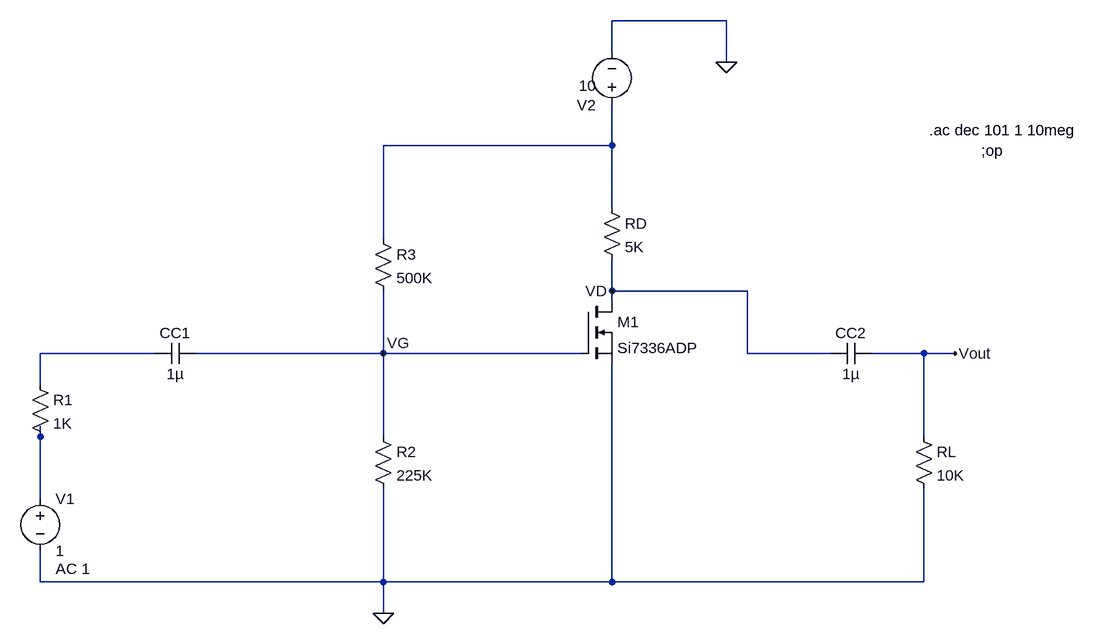
[diagram p0: schematic ec_exp1.asc]
ec_exp1.asc, the LTspice schematic file:
Version 4
SHEET 1 1740 680
WIRE 1184 -448 1008 -448
WIRE 1008 -400 1008 -448
WIRE 1184 -384 1184 -448
WIRE 1008 -256 1008 -320
WIRE 1008 -256 656 -256
WIRE 1008 -160 1008 -256
WIRE 656 -112 656 -256
WIRE 1008 -32 1008 -80
WIRE 1216 -32 1008 -32
WIRE 1008 -16 1008 -32
WIRE 304 64 128 64
WIRE 656 64 656 -32
WIRE 656 64 368 64
WIRE 960 64 656 64
WIRE 1216 64 1216 -32
WIRE 1344 64 1216 64
WIRE 1488 64 1408 64
WIRE 1536 64 1488 64
WIRE 128 112 128 64
WIRE 128 192 128 176
WIRE 656 192 656 64
WIRE 1488 192 1488 64
WIRE 128 288 128 192
WIRE 128 416 128 368
WIRE 656 416 656 272
WIRE 656 416 128 416
WIRE 1008 416 1008 80
WIRE 1008 416 656 416
WIRE 1488 416 1488 272
WIRE 1488 416 1008 416
WIRE 656 464 656 416
FLAG 1184 -384 0
FLAG 656 464 0
FLAG 656 64 VG
FLAG 1008 -32 VD
FLAG 1536 64 Vout
SYMBOL cap 304 48 M90
WINDOW 0 0 32 VBottom 2
WINDOW 3 32 32 VTop 2
SYMATTR InstName CC1
SYMATTR Value 1µ
SYMBOL res 112 96 R0
SYMATTR InstName R1
SYMATTR Value 1K
SYMBOL voltage 128 272 R0
WINDOW 123 24 124 Left 2
WINDOW 39 0 0 Left 0
SYMATTR Value2 AC 1
SYMATTR InstName V1
SYMATTR Value 1
SYMBOL voltage 1008 -304 R180
WINDOW 0 39 30 Bottom 2
WINDOW 3 24 44 Left 2
WINDOW 123 24 44 Left 2
WINDOW 39 0 0 Left 0
SYMATTR InstName V2
SYMATTR Value 10
SYMBOL res 640 176 R0
SYMATTR InstName R2
SYMATTR Value 225K
SYMBOL res 640 -128 R0
SYMATTR InstName R3
SYMATTR Value 500K
SYMBOL nmos 960 -16 R0
SYMATTR InstName M1
SYMATTR Value Si7336ADP
SYMBOL res 992 -176 R0
SYMATTR InstName RD
SYMATTR Value 5K
SYMBOL cap 1408 48 R90
WINDOW 0 0 32 VBottom 2
WINDOW 3 32 32 VTop 2
SYMATTR InstName CC2
SYMATTR Value 1µ
SYMBOL res 1472 176 R0
SYMATTR InstName RL
SYMATTR Value 10K
TEXT 1576 -248 Left 2 !;op
TEXT 1496 -280 Left 2 !.ac dec 101 1 10meg

The netlist it stands for:
* ec_exp1.asc
CC1 N002 VG 1µ
R1 N002 N003 1K
V1 N003 0 1 AC 1
V2 N001 0 10
R2 VG 0 225K
R3 N001 VG 500K
M1 VD VG 0 0 Si7336ADP
RD N001 VD 5K
CC2 Vout VD 1µ
RL Vout 0 10K
.model NMOS NMOS
.model PMOS PMOS
.lib standard.mos
;op
.ac dec 101 1 10meg
.backanno
.end